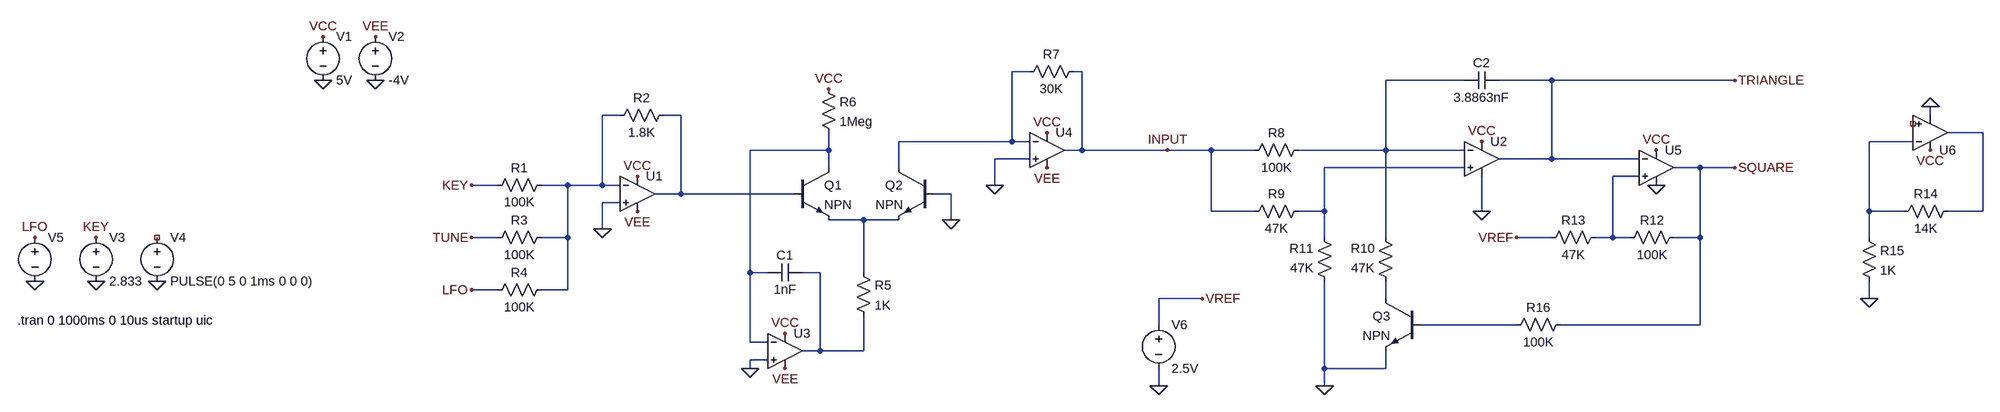
[diagram p0: schematic vco.asc]
vco.asc, the LTspice schematic file:
Version 4
SHEET 1 3220 680
WIRE 1136 -128 1104 -128
WIRE 1232 -128 1216 -128
WIRE 1936 -112 1792 -112
WIRE 2096 -112 2000 -112
WIRE 2432 -112 2096 -112
WIRE 352 -48 320 -48
WIRE 464 -48 432 -48
WIRE 3120 -48 3120 -64
WIRE 3216 -16 3152 -16
WIRE 1104 0 1104 -128
WIRE 1104 0 896 0
WIRE 1136 0 1104 0
WIRE 3088 0 3008 0
WIRE 768 16 768 -16
WIRE 768 16 624 16
WIRE 1232 16 1232 -128
WIRE 1232 16 1200 16
WIRE 1392 16 1232 16
WIRE 1472 16 1392 16
WIRE 1552 16 1472 16
WIRE 1792 16 1792 -112
WIRE 1792 16 1632 16
WIRE 1936 16 1792 16
WIRE 1136 32 1072 32
WIRE 2096 32 2096 -112
WIRE 2096 32 2000 32
WIRE 2256 32 2096 32
WIRE 768 48 768 16
WIRE 896 48 896 0
WIRE 1936 48 1680 48
WIRE 2368 48 2320 48
WIRE 2432 48 2368 48
WIRE 2256 64 2208 64
WIRE 128 80 80 80
WIRE 256 80 208 80
WIRE 320 80 320 -48
WIRE 320 80 256 80
WIRE 352 80 320 80
WIRE 1072 80 1072 32
WIRE 464 96 464 -48
WIRE 464 96 416 96
WIRE 704 96 464 96
WIRE 992 96 960 96
WIRE 352 112 320 112
WIRE 1472 128 1472 16
WIRE 1552 128 1472 128
WIRE 1680 128 1680 48
WIRE 1680 128 1632 128
WIRE 1968 128 1968 64
WIRE 3008 128 3008 0
WIRE 3072 128 3008 128
WIRE 3216 128 3216 -16
WIRE 3216 128 3152 128
WIRE 832 144 768 144
WIRE 896 144 832 144
WIRE 992 144 992 96
WIRE 320 160 320 112
WIRE 128 176 80 176
WIRE 256 176 256 80
WIRE 256 176 208 176
WIRE 1680 176 1680 128
WIRE 1792 176 1792 16
WIRE 2096 176 2032 176
WIRE 2208 176 2208 64
WIRE 2208 176 2176 176
WIRE 2240 176 2208 176
WIRE 2368 176 2368 48
WIRE 2368 176 2320 176
WIRE 3008 176 3008 128
WIRE 624 240 624 16
WIRE 656 240 624 240
WIRE 752 240 720 240
WIRE 832 240 832 144
WIRE 128 272 80 272
WIRE 256 272 256 176
WIRE 256 272 208 272
WIRE 1456 288 1376 288
WIRE 1792 288 1792 256
WIRE 3008 288 3008 256
WIRE 1376 336 1376 288
WIRE 2032 336 1856 336
WIRE 2368 336 2368 176
WIRE 2368 336 2112 336
WIRE 624 368 624 240
WIRE 656 368 624 368
WIRE 752 384 752 240
WIRE 752 384 720 384
WIRE 832 384 832 320
WIRE 832 384 752 384
WIRE 656 400 624 400
WIRE 624 416 624 400
WIRE 1680 416 1680 256
WIRE 1792 416 1792 384
WIRE 1792 416 1680 416
WIRE 1376 448 1376 416
WIRE 1680 448 1680 416
FLAG 384 64 VCC
FLAG 384 128 VEE
FLAG 320 160 0
FLAG -192 -112 0
FLAG -96 -112 0
FLAG -96 -192 VEE
FLAG -192 -192 VCC
FLAG 80 80 KEY
FLAG 80 176 TUNE
FLAG 80 272 LFO
FLAG -608 256 0
FLAG 688 416 VEE
FLAG 688 352 VCC
FLAG 624 416 0
FLAG 992 144 0
FLAG 768 -96 VCC
FLAG -496 256 0
FLAG -608 176 KEY
FLAG 1168 48 VEE
FLAG 1168 -16 VCC
FLAG 1072 80 0
FLAG 1968 0 VCC
FLAG 1680 448 0
FLAG 2288 16 VCC
FLAG -720 256 0
FLAG -720 176 LFO
FLAG 1968 128 0
FLAG 2288 80 0
FLAG 3120 16 VCC
FLAG 3120 -64 0
FLAG 3008 288 0
FLAG 1376 448 0
FLAG 2432 48 SQUARE
FLAG 2432 -112 TRIANGLE
FLAG 2032 176 VREF
FLAG 1456 288 VREF
FLAG 1392 16 INPUT
SYMBOL res 224 64 R90
WINDOW 0 0 56 VBottom 2
WINDOW 3 32 56 VTop 2
SYMATTR InstName R1
SYMATTR Value 100K
SYMBOL Opamps\\UniversalOpamp2 384 96 R0
SYMATTR InstName U1
SYMBOL res 448 -64 R90
WINDOW 0 0 56 VBottom 2
WINDOW 3 32 56 VTop 2
SYMATTR InstName R2
SYMATTR Value 1.8K
SYMBOL res 224 160 R90
WINDOW 0 0 56 VBottom 2
WINDOW 3 32 56 VTop 2
SYMATTR InstName R3
SYMATTR Value 100K
SYMBOL res 224 256 R90
WINDOW 0 0 56 VBottom 2
WINDOW 3 32 56 VTop 2
SYMATTR InstName R4
SYMATTR Value 100K
SYMBOL voltage -192 -208 R0
WINDOW 123 0 0 Left 2
WINDOW 39 0 0 Left 2
SYMATTR InstName V1
SYMATTR Value 5V
SYMBOL voltage -96 -208 R0
WINDOW 123 0 0 Left 2
WINDOW 39 0 0 Left 2
SYMATTR InstName V2
SYMATTR Value -4V
SYMBOL voltage -608 160 R0
WINDOW 123 0 0 Left 2
WINDOW 39 0 0 Left 2
SYMATTR InstName V3
SYMATTR Value 2.833
SYMBOL npn 704 48 R0
SYMATTR InstName Q1
SYMBOL npn 960 48 M0
SYMATTR InstName Q2
SYMBOL Opamps\\UniversalOpamp2 688 384 R0
SYMATTR InstName U3
SYMBOL cap 720 224 R90
WINDOW 0 0 32 VBottom 2
WINDOW 3 32 32 VTop 2
SYMATTR InstName C1
SYMATTR Value 1nF
SYMBOL res 816 224 R0
SYMATTR InstName R5
SYMATTR Value 1K
SYMBOL res 752 -112 R0
SYMATTR InstName R6
SYMATTR Value 1Meg
SYMBOL voltage -496 160 R0
WINDOW 123 0 0 Left 2
WINDOW 39 0 0 Left 2
SYMATTR InstName V4
SYMATTR Value PULSE(0 5 0 1ms 0 0 0)
SYMBOL Opamps\\UniversalOpamp2 1168 16 R0
SYMATTR InstName U4
SYMBOL res 1232 -144 R90
WINDOW 0 0 56 VBottom 2
WINDOW 3 32 56 VTop 2
SYMATTR InstName R7
SYMATTR Value 30K
SYMBOL Opamps\\UniversalOpamp2 1968 32 R0
SYMATTR InstName U2
SYMBOL res 1648 0 R90
WINDOW 0 0 56 VBottom 2
WINDOW 3 32 56 VTop 2
SYMATTR InstName R8
SYMATTR Value 100K
SYMBOL res 1648 112 R90
WINDOW 0 0 56 VBottom 2
WINDOW 3 32 56 VTop 2
SYMATTR InstName R9
SYMATTR Value 47K
SYMBOL res 1808 272 R180
WINDOW 0 36 76 Left 2
WINDOW 3 36 40 Left 2
SYMATTR InstName R10
SYMATTR Value 47K
SYMBOL res 1696 272 R180
WINDOW 0 36 76 Left 2
WINDOW 3 36 40 Left 2
SYMATTR InstName R11
SYMATTR Value 47K
SYMBOL npn 1856 288 M0
SYMATTR InstName Q3
SYMBOL cap 2000 -128 R90
WINDOW 0 0 32 VBottom 2
WINDOW 3 32 32 VTop 2
SYMATTR InstName C2
SYMATTR Value 3.8863nF
SYMBOL Opamps\\UniversalOpamp2 2288 48 R0
SYMATTR InstName U5
SYMBOL res 2336 160 R90
WINDOW 0 0 56 VBottom 2
WINDOW 3 32 56 VTop 2
SYMATTR InstName R12
SYMATTR Value 100K
SYMBOL res 2192 160 R90
WINDOW 0 0 56 VBottom 2
WINDOW 3 32 56 VTop 2
SYMATTR InstName R13
SYMATTR Value 47K
SYMBOL voltage -720 160 R0
WINDOW 123 0 0 Left 2
WINDOW 39 0 0 Left 2
SYMATTR InstName V5
SYMATTR Value ""
SYMBOL Opamps\\UniversalOpamp2 3120 -16 M180
SYMATTR InstName U6
SYMBOL res 3168 112 R90
WINDOW 0 0 56 VBottom 2
WINDOW 3 32 56 VTop 2
SYMATTR InstName R14
SYMATTR Value 14K
SYMBOL res 2992 160 R0
SYMATTR InstName R15
SYMATTR Value 1K
SYMBOL res 2128 320 R90
WINDOW 0 0 56 VBottom 2
WINDOW 3 32 56 VTop 2
SYMATTR InstName R16
SYMATTR Value 100K
SYMBOL voltage 1376 320 R0
WINDOW 123 0 0 Left 2
WINDOW 39 0 0 Left 2
SYMATTR InstName V6
SYMATTR Value 2.5V
TEXT -752 328 Left 2 !.tran 0 1000ms 0 10us startup uic

The netlist it stands for:
* vco.asc
R1 N003 KEY 100K
XU1 0 N003 VCC VEE N004 level.2 Avol=1Meg GBW=10Meg Slew=10Meg ilimit=25m rail=0 Vos=0 phimargin=45 en=0 enk=0 in=0 ink=0 Rin=500Meg  ; pins IN+ IN- V+ V- OUT
R2 N004 N003 1.8K
R3 N003 TUNE 100K
R4 N003 LFO 100K
V1 VCC 0 5V
V2 VEE 0 -4V
V3 KEY 0 2.833
Q1 N007 N004 N010 0 NPN
Q2 N001 0 N010 0 NPN
XU3 0 N007 VCC VEE N011 level.2 Avol=1Meg GBW=10Meg Slew=10Meg ilimit=25m rail=0 Vos=0 phimargin=45 en=0 enk=0 in=0 ink=0 Rin=500Meg  ; pins IN+ IN- V+ V- OUT
C1 N011 N007 1nF
R5 N010 N011 1K
R6 VCC N007 1Meg
V4 NC_01 0 PULSE(0 5 0 1ms 0 0 0)
XU4 0 N001 VCC VEE INPUT level.2 Avol=1Meg GBW=10Meg Slew=10Meg ilimit=25m rail=0 Vos=0 phimargin=45 en=0 enk=0 in=0 ink=0 Rin=500Meg  ; pins IN+ IN- V+ V- OUT
R7 INPUT N001 30K
XU2 N008 N002 VCC 0 TRIANGLE level.2 Avol=1Meg GBW=10Meg Slew=10Meg ilimit=25m rail=0 Vos=0 phimargin=45 en=0 enk=0 in=0 ink=0 Rin=500Meg  ; pins IN+ IN- V+ V- OUT
R8 N002 INPUT 100K
R9 N008 INPUT 47K
R10 N012 N002 47K
R11 0 N008 47K
Q3 N012 N013 0 0 NPN
C2 TRIANGLE N002 3.8863nF
XU5 N009 TRIANGLE VCC 0 SQUARE level.2 Avol=1Meg GBW=10Meg Slew=10Meg ilimit=25m rail=0 Vos=0 phimargin=45 en=0 enk=0 in=0 ink=0 Rin=500Meg  ; pins IN+ IN- V+ V- OUT
R12 SQUARE N009 100K
R13 N009 VREF 47K
V5 LFO 0
XU6 NC_02 N006 VCC 0 N005 level.2 Avol=1Meg GBW=10Meg Slew=10Meg ilimit=25m rail=0 Vos=0 phimargin=45 en=0 enk=0 in=0 ink=0 Rin=500Meg  ; pins IN+ IN- V+ V- OUT
R14 N005 N006 14K
R15 N006 0 1K
R16 SQUARE N013 100K
V6 VREF 0 2.5V
.model NPN NPN
.model PNP PNP
.lib standard.bjt
.tran 0 1000ms 0 10us startup uic
.lib UniversalOpamps2.sub
.backanno
.end